# EAGLE design max31865_breakout (EAGLE 7.0.0)
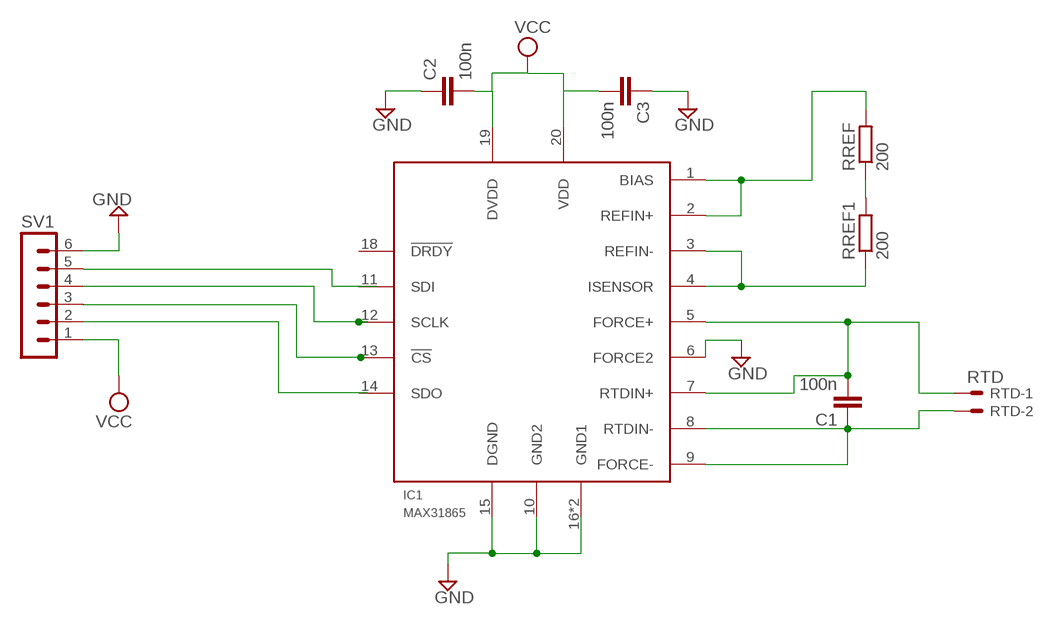
[diagram p0: schematic, sheet 1]

## Parts
C1  100n  C-EUC0805K  [C0805K]
C2  100n  C-EUC0805K  [C0805K]
C3  100n  C-EUC0805K  [C0805K]
IC1  MAX31865  [TQFN20-5X5]
RREF  200  R-EU_M1206  [M1206]
RREF1  200  R-EU_M1206  [M1206]
RTD  RTD  22-23-2021  [22-23-2021]
SV1  MA06-1  [MA06-1]

## Nets
CS: SV1.3
GND: C2.1 C3.1 IC1.6(FORCE2) IC1.10(GND2) IC1.15(DGND) IC1.16(GND1) IC1.EXP(GND1) SV1.6
N$2: RREF1.2 RREF.1
REFIN+: IC1.1(BIAS) IC1.2(REFIN+) RREF.2
REFIN-: IC1.3(REFIN-) IC1.4(ISENSOR) RREF1.1
RTD+: C1.2 IC1.5(FORCE+) IC1.7(RTDIN+) RTD.1
RTD-: C1.1 IC1.8(RTDIN-) IC1.9(FORCE-) RTD.2
SCLK: IC1.12(SCLK) SV1.4
SDI: SV1.5
SDO: SV1.2
VCC: C2.2 C3.2 IC1.19(DVDD) IC1.20(VDD) SV1.1
Unconnected: IC1.11(SDI) IC1.13(!CS) IC1.14(SDO) IC1.18(!DRDY)

## Library data of the parts
C1-C3 = rcl:C-EU: CAPACITOR, European symbol
IC1 = Oles komponentbibliotek:MAX31865: RTD to Digital Converter The MAX31865 is a resistance-to-digital converter optimized for platinum resistance temperature detectors (RTDs). An external resistor sets the sensitivity for the RTD being used and a delta-sigma ADC converts the ratio of the RTD resistance to the reference resistance into digital form. The MAX31865’s inputs are protected against overvoltage faults up to +/-50V. Programmable detection of RTD and cable open and short conditions is included.
RREF RREF1 = rcl:R-EU_: RESISTOR, European symbol
RTD = con-molex:22-23-2021: .100" (2.54mm) Center Header - 2 Pin; MF: MOLEX; MPN: 22-23-2021; OC_FARNELL: 1462926; OC_NEWARK: 25C3832
SV1 = con-lstb:MA06-1: PIN HEADER; OC_FARNELL: unknown; OC_NEWARK: unknown

## Board
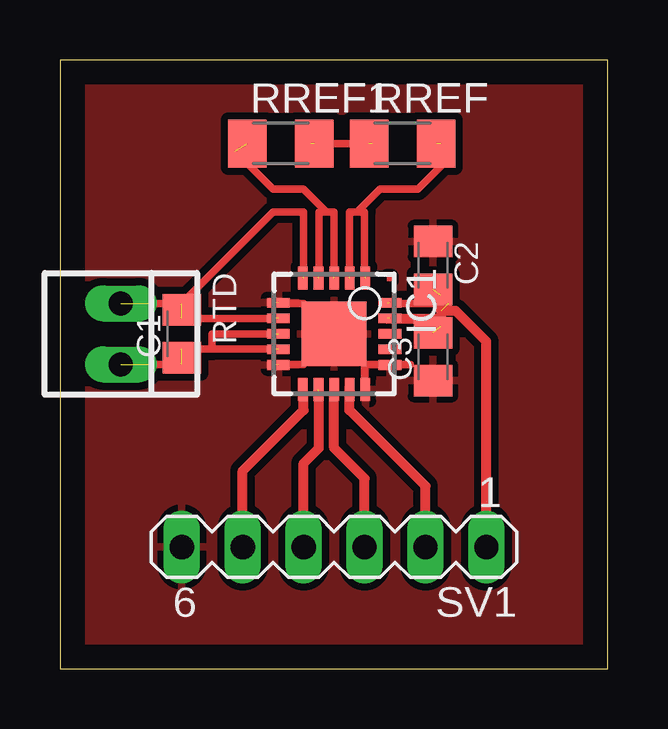
[diagram p1: board, top side]

Size 22.85 x 25.39 mm. Coordinates in mm from the lower left corner, seen from the top.
Outline: 0,0 22.85,0 22.85,25.39 0,25.39 0,0
Copper layers (1*16): Top 0.035mm / dielectric 1.5mm / Bottom 0.035mm
Design rules "default *": minimum track width 10mil, minimum drill 24mil, track to track 12mil, track to pad 12mil, pad to pad 12mil, via to via 12mil, smd to smd 12mil, copper to edge 40mil, drill to drill 8mil, minimum pad ring 10mil, minimum via ring 8mil, stop-mask expansion 4mil, vias tented up to drill 0mil, thermal gap 10mil
tRestrict: area 8.6,22.9 to 9.8,23.2; area 13.7,22.9 to 14.9,23.2

### Footprints (pad centres in the part's own frame; a part is rotated, then mirrored left to right if it is on the bottom)
C0805K = smd 1.3 x 1.6: 1 -1,0; 2 1,0
TQFN20-5X5 = smd 0.95 x 0.4: 1 -2.325,1.3; 2 -2.325,0.65; 3 -2.325,0; 4 -2.325,-0.65; 5 -2.325,-1.3; 11 2.325,-1.3; 12 2.325,-0.65; 13 2.325,0; 14 2.325,0.65; 15 2.325,1.3 | smd 0.4 x 0.95: 6 -1.3,-2.325; 7 -0.65,-2.325; 8 0,-2.325; 9 0.65,-2.325; 10 1.3,-2.325; 16 1.3,2.325; 17 0.65,2.325; 18 0,2.325; 19 -0.65,2.325; 20 -1.3,2.325 | smd 2.7 x 2.7: EXP 0,0
M1206 = smd 1.6 x 2: 1 -1.4,0; 2 1.4,0
22-23-2021 = drill 1 long: 1 -1.27,0; 2 1.27,0
MA06-1 = drill 1.016 long: 1 -6.35,0; 2 -3.81,0; 3 -1.27,0; 4 1.27,0; 5 3.81,0; 6 6.35,0

### Placement (x,y rotation side)
C1  5.08,13.97 90 top
C2  15.56,16.83 270 top
C3  15.56,13.02 90 top
IC1  11.43,13.97 270 top
RREF  14.29,21.91 0 top
RREF1  9.21,21.91 0 top
RTD  2.54,13.97 270 top
SV1  11.43,5.08 180 top

### Tracks (layer width: path | path; a pad name or v marks a point on that pad's centre or on a via)
CS
  Top 0.406: SV1.3 12.7,7.94 11.43,9.21 11.43,11.43
GND  (2 unrouted)
  Top 0.305: 12.7,12.7 12.7,11.43 | 12.7,12.7 14.61,12.7 | 8.89,15.24 10.16,15.24 IC1.EXP | 8.89,12.7 10.16,12.7 IC1.EXP | 12.7,12.7 IC1.EXP
  pour Top: 0,25.4 22.86,25.4 22.86,0 0,0
N$2  (2 unrouted)
  Top 0.305: 10.48,21.91 13.02,21.91
REFIN+  (3 unrouted)
  Top 0.305: 12.06,16.51 12.06,19.05 12.38,19.05 | 12.7,16.51 12.7,19.05 12.38,19.05 | 12.38,19.05 13.33,20 14.92,20 15.88,20.95 15.88,21.91
REFIN-  (3 unrouted)
  Top 0.305: 10.79,16.51 10.79,19.05 11.11,19.05 | 11.43,16.51 11.43,19.05 11.11,19.05 | 11.11,19.05 10.16,20 8.89,20 7.3,21.59
RTD+  (5 unrouted)
  Top 0.305: 8.89,14.61 5.08,14.61 | 3.81,15.24 5.08,15.24 8.89,19.05 10.16,19.05 10.16,16.51
RTD-  (5 unrouted)
  Top 0.305: 8.89,13.33 6.35,13.33 | 6.35,13.33 5.08,13.33 | 5.08,12.7 3.81,12.7 | 8.89,13.97 6.35,13.97 6.35,13.33
SCLK  (1 unrouted)
  Top 0.406: SV1.4 10.16,8.57 10.79,9.21 10.79,11.43
SDI
  Top 0.406: SV1.5 7.62,8.26 10.16,10.79 10.16,11.43
SDO
  Top 0.406: SV1.2 15.24,7.62 12.06,10.79 12.06,11.75
VCC  (5 unrouted)
  Top 0.305: 13.65,15.24 16.19,15.24
  Top 0.406: SV1.1 17.78,13.65 16.51,14.92 15.88,14.92 | 15.88,14.92 15.88,15.56 | 15.88,14.92 15.88,14.61 | 15.88,14.61 15.88,14.29 | 13.65,14.61 15.88,14.61